# Altium schematic sheet drvinput3.SchDoc
size A4
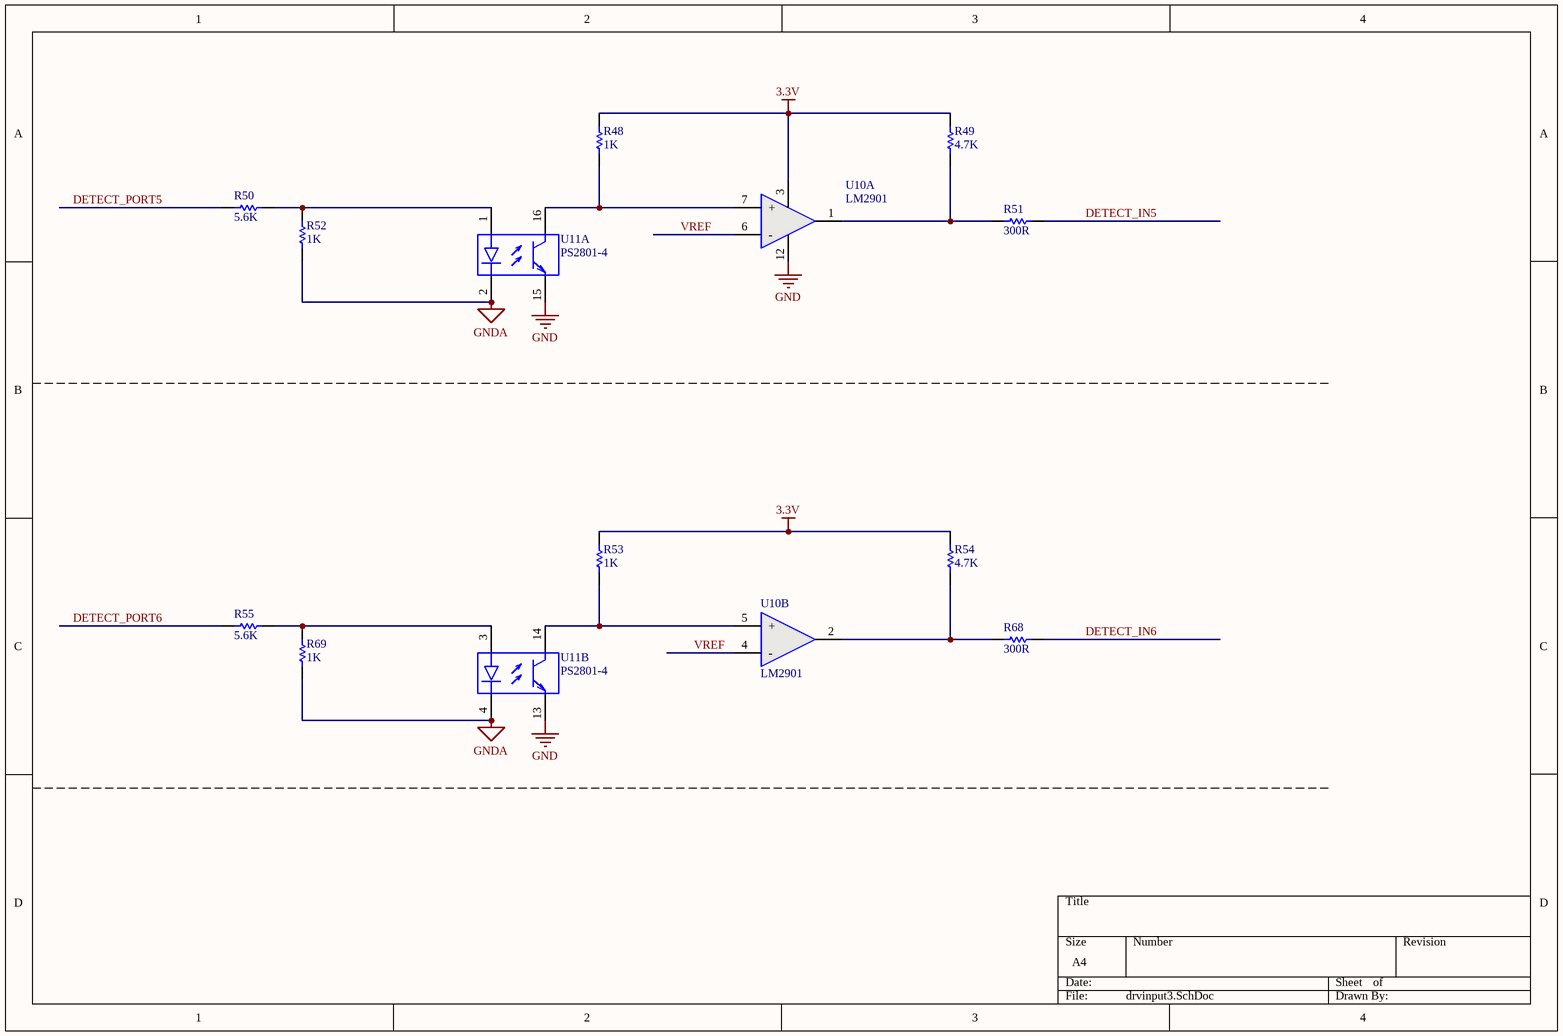
[diagram p0: drvinput3.SchDoc]

## Parts
R48  1K  [RESC2012M]
R49  4.7K  [RESC2012M]
R50  5.6K  [RESC2012M]
R51  300R  [RESC2012M]
R52  1K  [RESC2012M]
R53  1K  [RESC2012M]
R54  4.7K  [RESC2012M]
R55  5.6K  [RESC2012M]
R68  300R  [RESC2012M]
R69  1K  [RESC2012M]
U10  LM2901  [SOIC-14AM]  (parts A,B of 4)
U11  PS2801-4  [SOIC16_N]  (parts A,B of 4)

## Nets
3.3V: R48.1 R49.2 R53.1 R54.2 U10.3(V+)
GND: U10.12(V-) U11.13(E) U11.15(E)
GNDA: R52.1 R69.1 U11.2(-) U11.4(-)
DETECT_IN5: R51.1
DETECT_IN6: R68.2
DETECT_PORT5: R50.2
DETECT_PORT6: R55.2
VREF: U10.4(-) U10.6(-)
NetR48_2: R48.2 U10.7(+) U11.16(C)
NetR49_1: R49.1 R51.2 U10.1(OUT)
NetR50_1: R50.1 R52.2 U11.1(+)
NetR53_2: R53.2 U10.5(+) U11.14(C)
NetR54_1: R54.1 R68.1 U10.2(OUT)
NetR55_1: R55.1 R69.2 U11.3(+)

## Library data of the parts
R48-R55 R69 = Res1: Resistor; Value: 10K; Published: 8-Jun-2000; LatestRevisionDate: 17-Jul-2002; LatestRevisionNote: Re-released for DXP Platform.; PackageReference: AXIAL-0.3; Publisher: Altium Limited
R68 = Res1: Resistor; Value: 470; Published: 8-Jun-2000; LatestRevisionDate: 17-Jul-2002; LatestRevisionNote: Re-released for DXP Platform.; PackageReference: AXIAL-0.3; Publisher: Altium Limited
U10 = LM2901: 4通道差分比较器芯片
U11 = PS2801-4: The PS2801-1 and PS2801-4 are optically coupled isolators containing a GaAs light emitting diode and an NPN  silicon phototransistor in a plastic SOP for high density applications.; Published: 28-Feb-2003; LatestRevisionDate: 13-Apr-2006; LatestRevisionNote: IPC-7351 Footprint Added.; DatasheetVersion: Jan-2002, Rev. 7; PackageVersion: rev7, Jan-2002; PackageReference: 751-07; Publisher: Altium Limited; PackageDescription: 8-Pin Plastic Small Outline Integrated Circuit 1.27 mm Pitch; Code_JEDEC: MS-012-AA; Code_IPC: SOIC127P600-8; ComponentLink1Description: Manufacturer Link; ComponentLink1URL: http://www.onsemi.com/; ComponentLink2Description: Datasheet; ComponentLink2URL: http://www.onsemi.com/pub/Collateral/LM358-D.PDF